# Altium schematic sheet Analog Voltmeter Schematic.SchDoc
size A; SheetNumber: 1; SheetTotal: 1
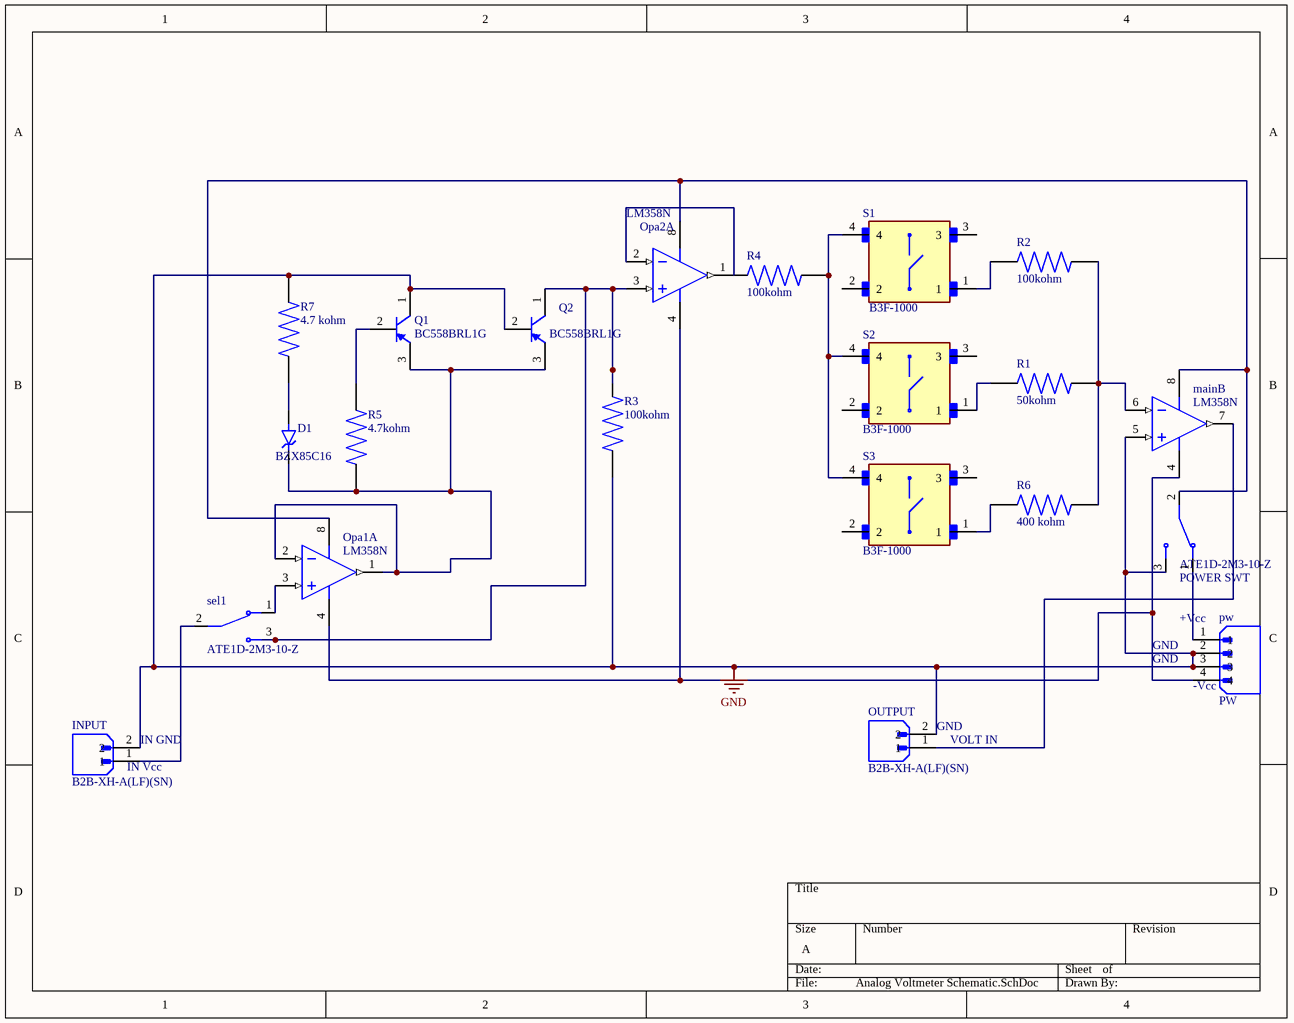
[diagram p0: Analog Voltmeter Schematic.SchDoc]

## Parts
D1  BZX85C16  [DIOAD1036W73L450D282]
INPUT  B2B-XH-A(LF)(SN)  [JST_B2B-XH-A(LF)(SN)]
main  LM358N  [ONSC-PDIP-8-626-05_M]  (part B of 2)
Opa1  LM358N  [ONSC-PDIP-8-626-05_M]  (part A of 2)
Opa2  LM358N  [ONSC-PDIP-8-626-05_M]  (part A of 2)
OUTPUT  B2B-XH-A(LF)(SN)  [JST_B2B-XH-A(LF)(SN)]
POWER_SWT  ATE1D-2M3-10-Z  [SW_ATE1D-2M3-10-Z]
pw  PW  [JST_B4B-XH-A(LF)(SN)]
Q1  BC558BRL1G  [ONSC-TO-92-3-29-11_AM_BL]
Q2  BC558BRL1G  [ONSC-TO-92-3-29-11_AM_BL]
R1  50kohm  [RESAD1081W64L635D269]
R2  100kohm  [RESAD1081W64L635D269]
R3  100kohm  [RESAD1081W64L635D269]
R4  100kohm  [RESAD1081W64L635D269]
R5  4.7kohm  [RESAD1081W64L635D269]
R6  400 kohm  [RESAD1081W64L635D269]
R7  4.7 kohm  [RESAD1081W64L635D269]
S1  B3F-1000  [SW_B3F-1000]
S2  B3F-1000  [SW_B3F-1000]
S3  B3F-1000  [SW_B3F-1000]
sel1  ATE1D-2M3-10-Z  [SW_ATE1D-2M3-10-Z]

## Nets
GND: INPUT.2 main.5(INB+) OUTPUT.2 POWER_SWT.3 pw.2 pw.3 Q1.1(C) Q2.2(B) R3.1 R7.2
NetD1_A: D1.A R7.1
NetD1_C: D1.C(K) Opa1.1(OUTA) Opa1.2(INA-) Q1.3(E) Q2.3(E) R5.1
NetINPUT_1: INPUT.1 sel1.2
Netmain_4: main.4(VEE/GND) Opa1.4(VEE/GND) Opa2.4(VEE/GND) pw.4
Netmain_6: main.6(INB-) R1.1 R2.2 R6.2
Netmain_7: main.7(OUTB) OUTPUT.1
Netmain_8: main.8(VCC) Opa1.8(VCC) Opa2.8(VCC) POWER_SWT.2
NetOpa1_3: Opa1.3(INA+) sel1.1
NetOpa2_1: Opa2.1(OUTA) Opa2.2(INA-)
NetOpa2_3: Opa2.3(INA+) Q2.1(C) R3.2 sel1.3
NetPOWER_SWT_1: POWER_SWT.1 pw.1
NetQ1_2: Q1.2(B) R5.2
NetR1_2: R1.2 S2.1
NetR2_1: R2.1 S1.1
NetR4_2: R4.2 S1.4 S2.4 S3.4
NetR6_1: R6.1 S3.1

Not connected (* = marked no-connect by the designer): R4 1; S1 2 3; S2 2 3; S3 2 3

## Notes on the sheet
- (near pw) +Vcc
- (near pw) GND
- (near pw) -Vcc
- (near INPUT) IN Vcc
- (near INPUT) IN GND
- (near OUTPUT) GND
- (near OUTPUT) VOLT IN

## Library data of the parts
INPUT OUTPUT = B2B-XH-A(LF)(SN): Connector Header Through Hole 2 position 0.098 (2.50mm); MF: JST Sales; SnapEDA_Link: https://www.snapeda.com/parts/B2B-XH-A(LF)(SN)/JST+Sales+America+Inc./view-part/?ref=snap; Package: None; Value: *; MP: B2B-XH-A(LF)(SN); Check_prices: https://www.snapeda.com/parts/B2B-XH-A(LF)(SN)/JST+Sales+America+Inc./view-part/?ref=eda
main Opa1 Opa2 = CMP-1310-00098-1: Single Supply Dual Operational Amplifier, 3 to 32 V, 0 to 70 degC, 8-Pin PDIP, Tube; Manufacturer: On Semiconductor; VCC Max (V): 32; VCC Min (V): 3; Mounting Technology: Through Hole; ComponentLink3Description: Package Specification; ComponentLink3URL: http://www.onsemi.com/pub_link/Collateral/LM211-D.PDF; RoHS: FALSE; Packing: Tube; PackageDescription: 8-Pin Plastic Dual-In Line Package, Body 9.52 x 6.605 mm, Pitch 2.54 mm; PackageReference: PDIP-8-626-05; PackageVersion: Rev. M, 04/2010; PartNumber: LM358N; ComponentLink2Description: Datasheet; ComponentLink2URL: http://www.onsemi.cn/pub_link/Collateral/LM358-D.PDF; ComponentLink1URL: http://www.onsemi.com/; ComponentLink1Description: Manufacturer URL; DatasheetVersion: Rev. 27
POWER_SWT sel1 = ATE1D-2M3-10-Z: Toggle Switch SPDT Through Hole; MF: Nidec Copal Electronics; Purchase-URL: https://pricing.snapeda.com/search/part/ATE1D-2M3-10-Z/?ref=eda; Package: None; Check_prices: https://www.snapeda.com/parts/ATE1D-2M3-10-Z/Nidec+Copal+Electronics/view-part/?ref=eda; Digi-Key_Part_Number: 563-1157-ND; Value: *; MP: ATE1D-2M3-10-Z; SnapEDA_Link: https://www.snapeda.com/parts/ATE1D-2M3-10-Z/Nidec+Copal+Electronics/view-part/?ref=snap
pw = B4B-XH-A(LF)(SN): Connector Header Through Hole 4 position 0.098 (2.50mm); MF: JST Sales; SnapEDA_Link: https://www.snapeda.com/parts/B4B-XH-A(LF)(SN)/JST+Sales+America+Inc./view-part/?ref=snap; Package: None; MP: B4B-XH-A(LF)(SN); Check_prices: https://www.snapeda.com/parts/B4B-XH-A(LF)(SN)/JST+Sales+America+Inc./view-part/?ref=eda; Purchase-URL: https://pricing.snapeda.com/search/part/B4B-XH-A(LF)(SN)/?ref=eda; Price: None; Value: *; Availability: In Stock
Q1 Q2 = CMP-1048-01513-1: Amplifier Transistor, PNP Silicon, 3-Pin TO-92, Pb-Free, Tape and Reel; Manufacturer: On Semiconductor; IC Continuous (A): -0.1; ComponentLink1Description: Manufacturer URL; PackageReference: TO-92-3-29-11_AM_BL; ComponentLink3URL: http://www.onsemi.com/pub_link/Collateral/MAC97-D.PDF; ComponentLink1URL: http://www.onsemi.com/; Polarity: PNP; ComponentLink2Description: Datasheet; PartNumber: BC558BRL1G; PackageDescription: 3-Pin Transistor Outline, Body 4.825 x 3.685 mm, Pitch 1.27 mm; ComponentLink2URL: http://www.onsemi.com/pub_link/Collateral/BC556B-D.PDF; DatasheetVersion: Rev. 3; ComponentLink3Description: Package Specification; Packing: Tape and Reel; RoHS: TRUE; Mounting Technology: Through Hole; PackageVersion: Rev. AM
R1 = RNC55J5002BSB14: Resistor,Metal Film,ERC-55 50K .1% T-9 RNC55J5002BS B14 | Vishay Dale RNC55J5002BSB14; SnapEDA_Link: https://www.snapeda.com/parts/RNC55J5002BSB14/Vishay/view-part/?ref=snap; Package: erc55 Vishay; Value: *; MF: Vishay; MP: RNC55J5002BSB14; Check_prices: https://www.snapeda.com/parts/RNC55J5002BSB14/Vishay/view-part/?ref=eda
R2-R4 = RNC55H1003FSRE6: 100 kOhms Â±1% 0.125W, 1/8W Through Hole Resistor Axial Military, Moisture Resistant, Weldable Metal Film; MF: Vishay; Purchase-URL: https://pricing.snapeda.com/search/part/RNC55H1003FSRE6/?ref=eda; Package: None; Check_prices: https://www.snapeda.com/parts/RNC55H1003FSRE6/Vishay/view-part/?ref=eda; SnapEDA_Link: https://www.snapeda.com/parts/RNC55H1003FSRE6/Vishay/view-part/?ref=snap; MP: RNC55H1003FSRE6; Value: *; Availability: In Stock; Price: None
R5 R7 = RNC55K4701FSRE6: Res Metal Film 4.7K Ohm 1% 0.125W(1/8W) Â±100ppm/Â°C 0.001% Epoxy AXL T/R; MF: Vishay; SnapEDA_Link: https://www.snapeda.com/parts/RNC55K4701FSRE6/Vishay/view-part/?ref=snap; Package: erc55 Vishay; Value: *; MP: RNC55K4701FSRE6; Check_prices: https://www.snapeda.com/parts/RNC55K4701FSRE6/Vishay/view-part/?ref=eda
R6 = RNC55J4003FSB14: Resistor,Metal Film,ERC-55 400K 1% T-9 RNC55J4003FS B14 | Vishay Dale RNC55J4003FSB14; SnapEDA_Link: https://www.snapeda.com/parts/RNC55J4003FSB14/Vishay/view-part/?ref=snap; Package: erc55 Vishay; Value: *; MF: Vishay; MP: RNC55J4003FSB14; Check_prices: https://www.snapeda.com/parts/RNC55J4003FSB14/Vishay/view-part/?ref=eda
S1-S3 = B3F-1000: Tactile Switch SPST-NO Top Actuated Through Hole; MF: Omron; Price: None; Check_prices: https://www.snapeda.com/parts/B3F-1000/Omron+Electronics+Inc-EMC+Div/view-part/?ref=eda; Purchase-URL: https://pricing.snapeda.com/search/part/B3F-1000/?ref=eda; Value: *; Package: None; Availability: In Stock; MP: B3F-1000; SnapEDA_Link: https://www.snapeda.com/parts/B3F-1000/Omron+Electronics+Inc-EMC+Div/view-part/?ref=snap
D1 = BZX85C16: Value: *; Availability: Unavailable; Price: None; MP: BZX85C16; Package: None